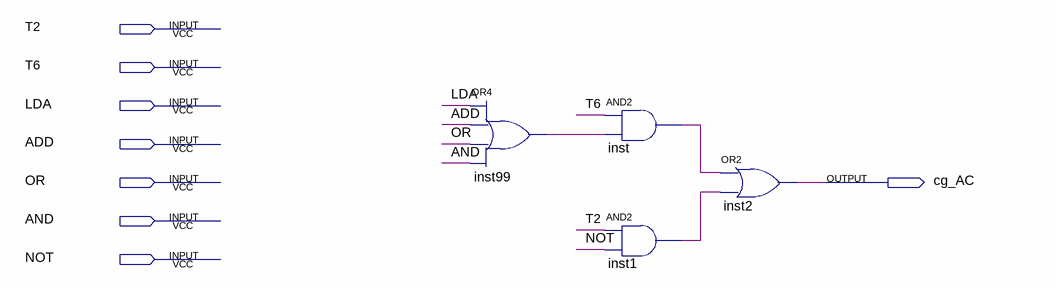
[diagram p0: schematic sheet]
// Quartus schematic abk_carga_ac.bdf as structural Verilog: 4 symbols, 8 pins
module abk_carga_ac (
  input  T2,
  input  T6,
  input  LDA,
  input  ADD,
  input  OR,
  input  AND,
  input  NOT,
  output cg_AC
);

  wire inst1_out, inst99_out, inst_out;

  or inst99 (inst99_out, LDA, ADD, OR, AND);
  and inst (inst_out, T6, inst99_out);
  and inst1 (inst1_out, T2, NOT);
  or inst2 (cg_AC, inst_out, inst1_out);
endmodule
